# Altium schematic sheet ts2068Interface.SchDoc
size A; SheetNumber: 2; SheetTotal: 5
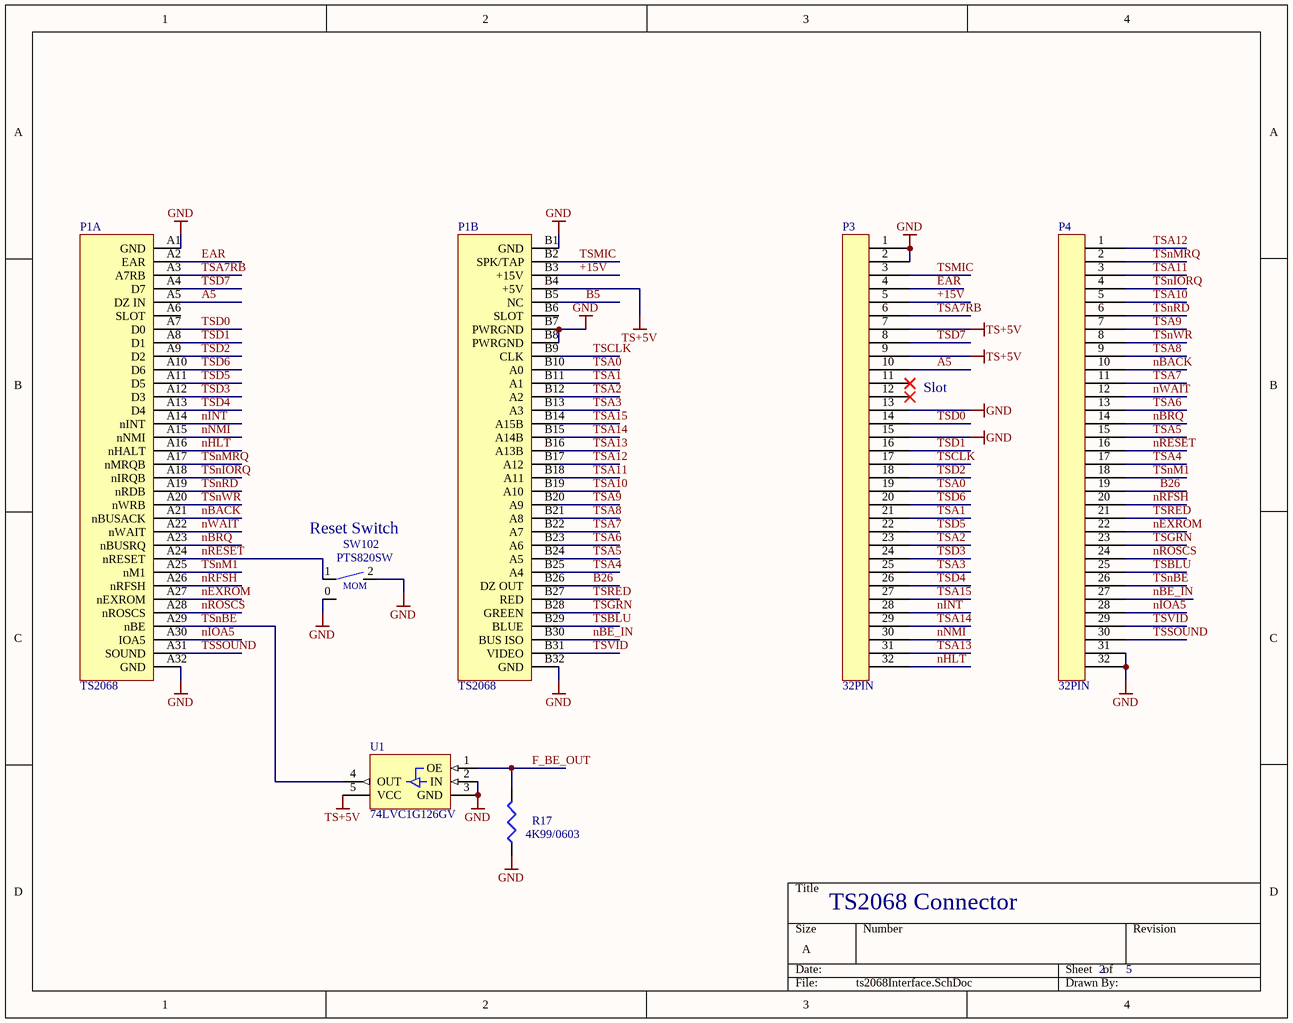
[diagram p0: ts2068Interface.SchDoc]

## Parts
P1  TS2068  [TS2068A]  (parts A,B of 2)
P3  32PIN  [IDC32]
P4  32PIN  [IDC32]
R17  4K99/0603  [0603]
SW102  PTS820SW  [PTS820]
U1  74LVC1G126GV  [SOT23-5]

## Nets
GND: P1.A1(GND) P1.A32(GND) P1.B1(GND) P1.B7(PWRGND) P1.B8(PWRGND) P1.B32(GND) P3.1 P3.2 P3.13 P3.15 P4.31 P4.32 R17.1 SW102.0 SW102.2 U1.2(IN) U1.3(GND)
TS+5V: P1.B4(+5V) P3.7 P3.9 U1.5(VCC)
+15V: P1.B3(+15V) P3.5
A5: P1.A5(DZ_IN) P3.10
B5: P1.B5(NC)
B26: P1.B26(DZ_OUT) P4.19
EAR: P1.A2(EAR) P3.4
F_BE_OUT: R17.2 U1.1(OE)
nBACK: P1.A21(nBUSACK) P4.10
nBE_IN: P1.B30(BUS_ISO) P4.27
nBRQ: P1.A23(nBUSRQ) P4.14
nEXROM: P1.A27(nEXROM) P4.22
nHLT: P1.A16(nHALT) P3.32
nINT: P1.A14(nINT) P3.28
nIOA5: P1.A30(IOA5) P4.28
nNMI: P1.A15(nNMI) P3.30
nRESET: P1.A24(nRESET) P4.16 SW102.1
nRFSH: P1.A26(nRFSH) P4.20
nROSCS: P1.A28(nROSCS) P4.24
nWAIT: P1.A22(nWAIT) P4.12
TSA0: P1.B10(A0) P3.19
TSA1: P1.B11(A1) P3.21
TSA2: P1.B12(A2) P3.23
TSA3: P1.B13(A3) P3.25
TSA4: P1.B25(A4) P4.17
TSA5: P1.B24(A5) P4.15
TSA6: P1.B23(A6) P4.13
TSA7: P1.B22(A7) P4.11
TSA7RB: P1.A3(A7RB) P3.6
TSA8: P1.B21(A8) P4.9
TSA9: P1.B20(A9) P4.7
TSA10: P1.B19(A10) P4.5
TSA11: P1.B18(A11) P4.3
TSA12: P1.B17(A12) P4.1
TSA13: P1.B16(A13B) P3.31
TSA14: P1.B15(A14B) P3.29
TSA15: P1.B14(A15B) P3.27
TSBLU: P1.B29(BLUE) P4.25
TSCLK: P1.B9(CLK) P3.17
TSD0: P1.A7(D0) P3.14
TSD1: P1.A8(D1) P3.16
TSD2: P1.A9(D2) P3.18
TSD3: P1.A12(D3) P3.24
TSD4: P1.A13(D4) P3.26
TSD5: P1.A11(D5) P3.22
TSD6: P1.A10(D6) P3.20
TSD7: P1.A4(D7) P3.8
TSGRN: P1.B28(GREEN) P4.23
TSMIC: P1.B2(SPK/TAP) P3.3
TSnBE: P1.A29(nBE) P4.26 U1.4(OUT)
TSnIORQ: P1.A18(nIRQB) P4.4
TSnM1: P1.A25(nM1) P4.18
TSnMRQ: P1.A17(nMRQB) P4.2
TSnRD: P1.A19(nRDB) P4.6
TSnWR: P1.A20(nWRB) P4.8
TSRED: P1.B27(RED) P4.21
TSSOUND: P1.A31(SOUND) P4.30
TSVID: P1.B31(VIDEO) P4.29

Not connected (* = marked no-connect by the designer): P1 A6(SLOT) B6(SLOT); P3 11* 12*

## Notes on the sheet
- Slot
- (near SW102) Reset Switch
- TS2068 Connector
- (in symbol PTS820SW) MOM

## Library data of the parts
R17 = 4K99/0603: RES 4.99K OHM 1/10W 1% 0603 SMD; MFG: Dale/Vishay; MFG PN: CRCW06034K99FKEAC; DK PN: 541-3985-1-ND; Price: 5.02
SW102 = PTS820SW: Tactile Switch SPST-NO Top Actuated Surface Mount; MFG: C&K; MFG PN: PTS820 J20M SMTR LFS; DK PN: CKN10505CT-ND
U1 = 74LVC1G126GV: Buffer, Non-Inverting 1 Element 1 Bit per Element 3-State Output SC-74A; MFG: Nexperia; MFG PN: 74LVC1G126GV,125; DK PN: 1727-6066-1-ND; Price: 1.17
P1 = TS2068: Populate: *
P3 P4 = 32PIN: MFG: *; MFG PN: *; DK PN: *; Price: *